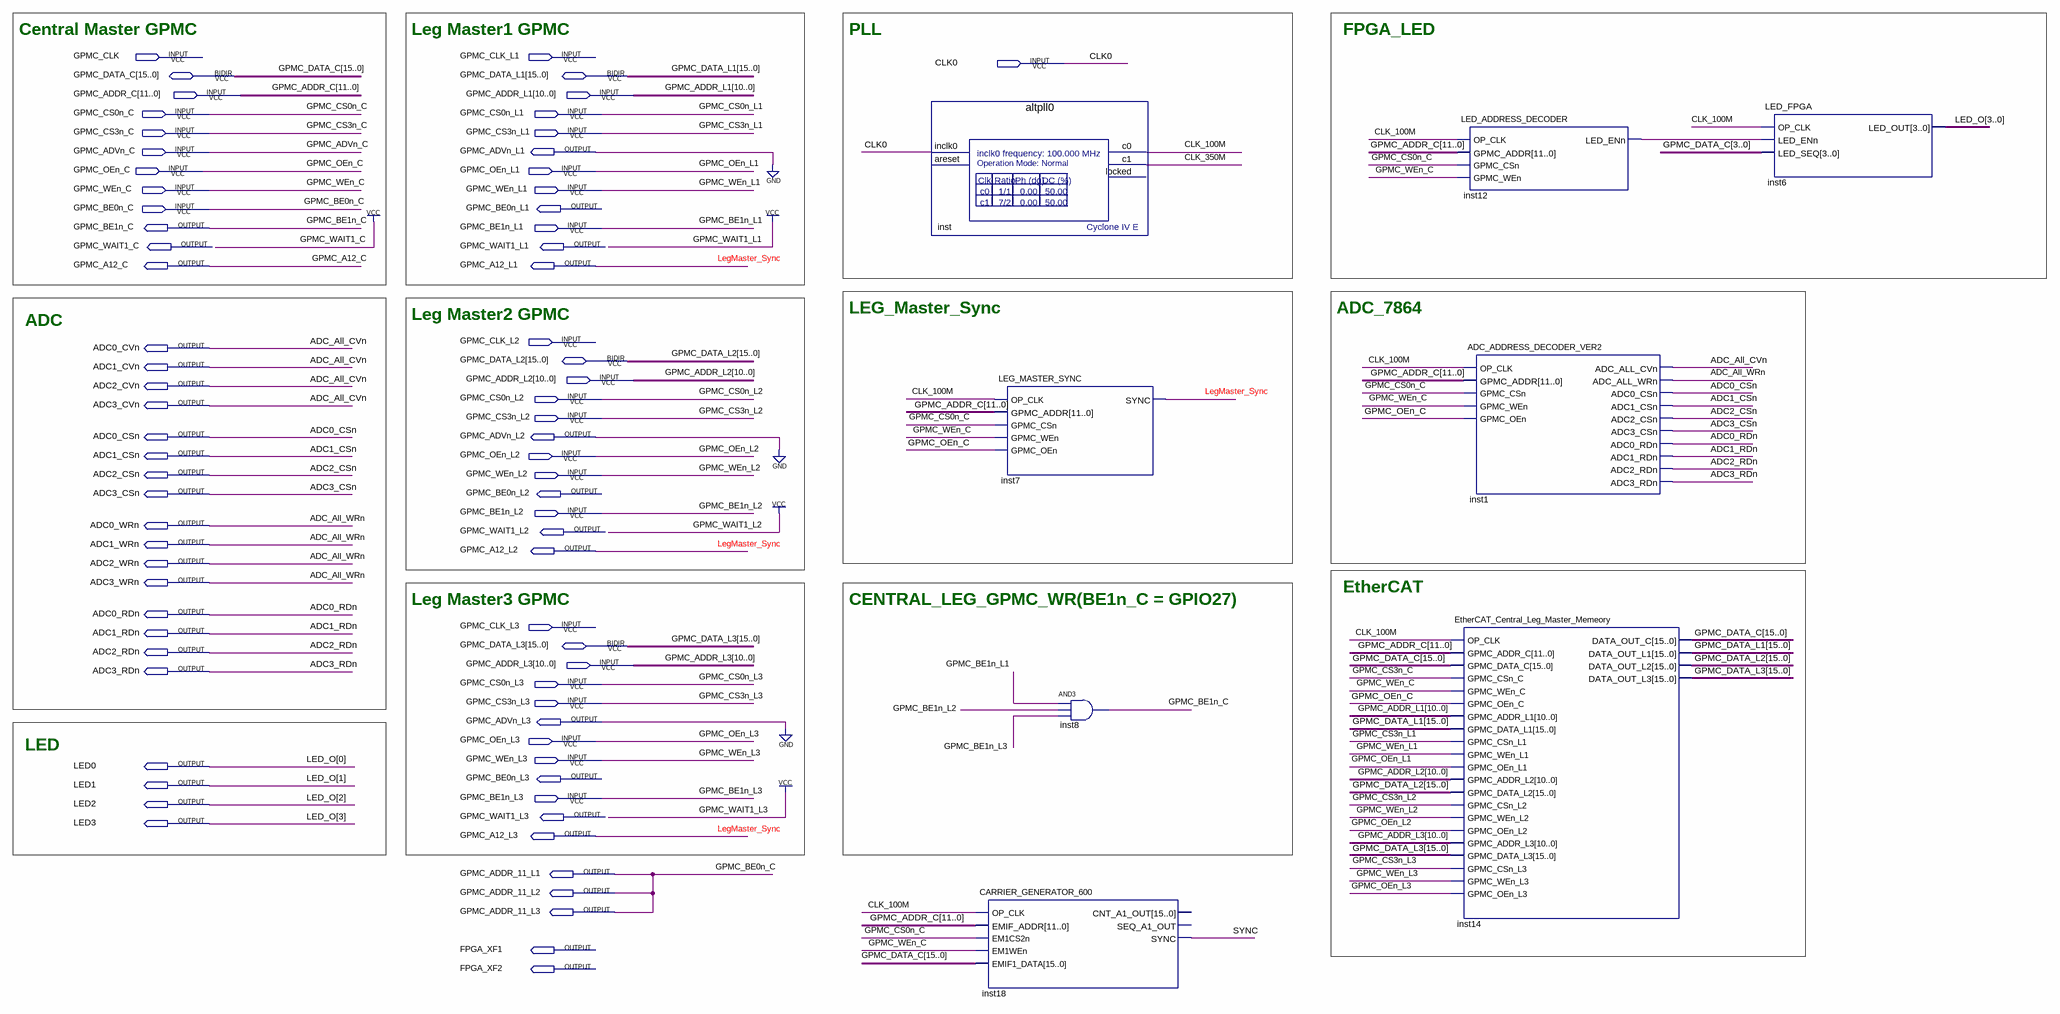
[diagram p0: schematic sheet]
// Quartus schematic Master_31Lv_FPGA.bdf as structural Verilog: 8 symbols, 74 pins
module Master_31Lv_FPGA (
  input  GPMC_CLK,
  input  GPMC_CLK_L1,
  input  CLK0,
  input  [11:0] GPMC_ADDR_C,
  input  [10:0] GPMC_ADDR_L1,
  input  GPMC_CS0n_C,
  input  GPMC_CS0n_L1,
  input  GPMC_CS3n_C,
  input  GPMC_CS3n_L1,
  input  GPMC_ADVn_C,
  input  GPMC_OEn_C,
  input  GPMC_OEn_L1,
  input  GPMC_WEn_C,
  input  GPMC_WEn_L1,
  input  GPMC_BE0n_C,
  input  GPMC_BE1n_L1,
  input  GPMC_CLK_L2,
  input  [10:0] GPMC_ADDR_L2,
  input  GPMC_CS0n_L2,
  input  GPMC_CS3n_L2,
  input  GPMC_OEn_L2,
  input  GPMC_WEn_L2,
  input  GPMC_BE1n_L2,
  input  GPMC_CLK_L3,
  input  [10:0] GPMC_ADDR_L3,
  input  GPMC_CS0n_L3,
  input  GPMC_CS3n_L3,
  input  GPMC_OEn_L3,
  input  GPMC_WEn_L3,
  input  GPMC_BE1n_L3,
  inout  [15:0] GPMC_DATA_C,
  inout  [15:0] GPMC_DATA_L1,
  inout  [15:0] GPMC_DATA_L2,
  inout  [15:0] GPMC_DATA_L3,
  output GPMC_ADVn_L1,
  output GPMC_BE0n_L1,
  output GPMC_BE1n_C,
  output GPMC_WAIT1_C,
  output GPMC_WAIT1_L1,
  output GPMC_A12_C,
  output GPMC_A12_L1,
  output ADC0_CVn,
  output ADC1_CVn,
  output ADC2_CVn,
  output ADC3_CVn,
  output ADC0_CSn,
  output GPMC_ADVn_L2,
  output ADC1_CSn,
  output ADC2_CSn,
  output ADC3_CSn,
  output GPMC_BE0n_L2,
  output ADC0_WRn,
  output GPMC_WAIT1_L2,
  output ADC1_WRn,
  output GPMC_A12_L2,
  output ADC2_WRn,
  output ADC3_WRn,
  output ADC0_RDn,
  output ADC1_RDn,
  output ADC2_RDn,
  output ADC3_RDn,
  output GPMC_ADVn_L3,
  output LED0,
  output GPMC_BE0n_L3,
  output LED1,
  output LED2,
  output GPMC_WAIT1_L3,
  output LED3,
  output GPMC_A12_L3,
  output GPMC_ADDR_11_L1,
  output GPMC_ADDR_11_L2,
  output GPMC_ADDR_11_L3,
  output FPGA_XF1,
  output FPGA_XF2
);

  wire CLK_100M, CLK_350M, inst12_led_enn, SYNC;

  altpll0 inst (.inclk0(CLK0), .c0(CLK_100M), .c1(CLK_350M));  // open: areset, locked
  CARRIER_GENERATOR_600 inst18 (
    .OP_CLK(CLK_100M), .EMIF_ADDR(GPMC_ADDR_C), .EM1CS2n(GPMC_CS0n_C), .EM1WEn(GPMC_WEn_C),
    .EMIF1_DATA(GPMC_DATA_C), .SYNC(SYNC));  // open: CNT_A1_OUT, SEQ_A1_OUT
  LEG_MASTER_SYNC inst7 (
    .OP_CLK(CLK_100M), .GPMC_ADDR(GPMC_ADDR_C), .GPMC_CSn(GPMC_CS0n_C), .GPMC_WEn(GPMC_WEn_C),
    .GPMC_OEn(GPMC_OEn_C), .SYNC(GPMC_A12_L1));
  and inst8 (GPMC_BE1n_C, GPMC_BE1n_L1, GPMC_BE1n_L2, GPMC_BE1n_L3);
  LED_ADDRESS_DECODER inst12 (
    .OP_CLK(CLK_100M), .GPMC_ADDR(GPMC_ADDR_C), .GPMC_CSn(GPMC_CS0n_C), .GPMC_WEn(GPMC_WEn_C),
    .LED_ENn(inst12_led_enn));
  ADC_ADDRESS_DECODER_VER2 inst1 (
    .OP_CLK(CLK_100M), .GPMC_ADDR(GPMC_ADDR_C), .GPMC_CSn(GPMC_CS0n_C), .GPMC_WEn(GPMC_WEn_C),
    .GPMC_OEn(GPMC_OEn_C), .ADC_ALL_CVn(ADC0_CVn), .ADC_ALL_WRn(ADC0_WRn), .ADC0_CSn(ADC0_CSn),
    .ADC1_CSn(ADC1_CSn), .ADC2_CSn(ADC2_CSn), .ADC3_CSn(ADC3_CSn), .ADC0_RDn(ADC0_RDn), .ADC1_RDn(ADC1_RDn),
    .ADC2_RDn(ADC2_RDn), .ADC3_RDn(ADC3_RDn));
  EtherCAT_Central_Leg_Master_Memeory inst14 (
    .OP_CLK(CLK_100M), .GPMC_ADDR_C(GPMC_ADDR_C), .GPMC_DATA_C(GPMC_DATA_C), .GPMC_CSn_C(GPMC_CS3n_C),
    .GPMC_WEn_C(GPMC_WEn_C), .GPMC_OEn_C(GPMC_OEn_C), .GPMC_ADDR_L1(GPMC_ADDR_L1),
    .GPMC_DATA_L1(GPMC_DATA_L1), .GPMC_CSn_L1(GPMC_CS3n_L1), .GPMC_WEn_L1(GPMC_WEn_L1),
    .GPMC_OEn_L1(GPMC_OEn_L1), .GPMC_ADDR_L2(GPMC_ADDR_L2), .GPMC_DATA_L2(GPMC_DATA_L2),
    .GPMC_CSn_L2(GPMC_CS3n_L2), .GPMC_WEn_L2(GPMC_WEn_L2), .GPMC_OEn_L2(GPMC_OEn_L2),
    .GPMC_ADDR_L3(GPMC_ADDR_L3), .GPMC_DATA_L3(GPMC_DATA_L3), .GPMC_CSn_L3(GPMC_CS3n_L3),
    .GPMC_WEn_L3(GPMC_WEn_L3), .GPMC_OEn_L3(GPMC_OEn_L3), .DATA_OUT_C(GPMC_DATA_C),
    .DATA_OUT_L1(GPMC_DATA_L1), .DATA_OUT_L2(GPMC_DATA_L2), .DATA_OUT_L3(GPMC_DATA_L3));
  LED_FPGA inst6 (
    .OP_CLK(CLK_100M), .LED_ENn(inst12_led_enn), .LED_SEQ(GPMC_DATA_C[3:0]),
    .LED_OUT({LED3, LED2, LED1, LED0}));

  assign ADC1_CVn = ADC0_CVn;
  assign ADC1_WRn = ADC0_WRn;
  assign ADC2_CVn = ADC0_CVn;
  assign ADC2_WRn = ADC0_WRn;
  assign ADC3_CVn = ADC0_CVn;
  assign ADC3_WRn = ADC0_WRn;
  assign GPMC_A12_L2 = GPMC_A12_L1;
  assign GPMC_A12_L3 = GPMC_A12_L1;
  assign GPMC_ADDR_11_L1 = GPMC_BE0n_C;
  assign GPMC_ADDR_11_L2 = GPMC_BE0n_C;
  assign GPMC_ADDR_11_L3 = GPMC_BE0n_C;
  assign GPMC_ADVn_L1 = 1'b0;
  assign GPMC_ADVn_L2 = 1'b0;
  assign GPMC_ADVn_L3 = 1'b0;
  assign GPMC_WAIT1_C = 1'b1;
  assign GPMC_WAIT1_L1 = 1'b1;
  assign GPMC_WAIT1_L2 = 1'b1;
  assign GPMC_WAIT1_L3 = 1'b1;

  // Other names for the same wires on the sheet: ADC_All_CVn = ADC0_CVn; ADC_All_WRn = ADC0_WRn;
  //   LED_O[3:0] = {LED3, LED2, LED1, LED0}; LegMaster_Sync = GPMC_A12_L1

  // Notes on the sheet:
  //   Central Master GPMC
  //   Leg Master1 GPMC
  //   PLL
  //   FPGA_LED
  //   LEG_Master_Sync
  //   ADC_7864
  //   Leg Master2 GPMC
  //   ADC
  //   EtherCAT
  //   Leg Master3 GPMC
  //   CENTRAL_LEG_GPMC_WR(BE1n_C = GPIO27)
  //   LED
endmodule
